# Altium schematic sheet STM32_AUX.SchDoc
size A4; SheetNumber: 8; SheetTotal: 13
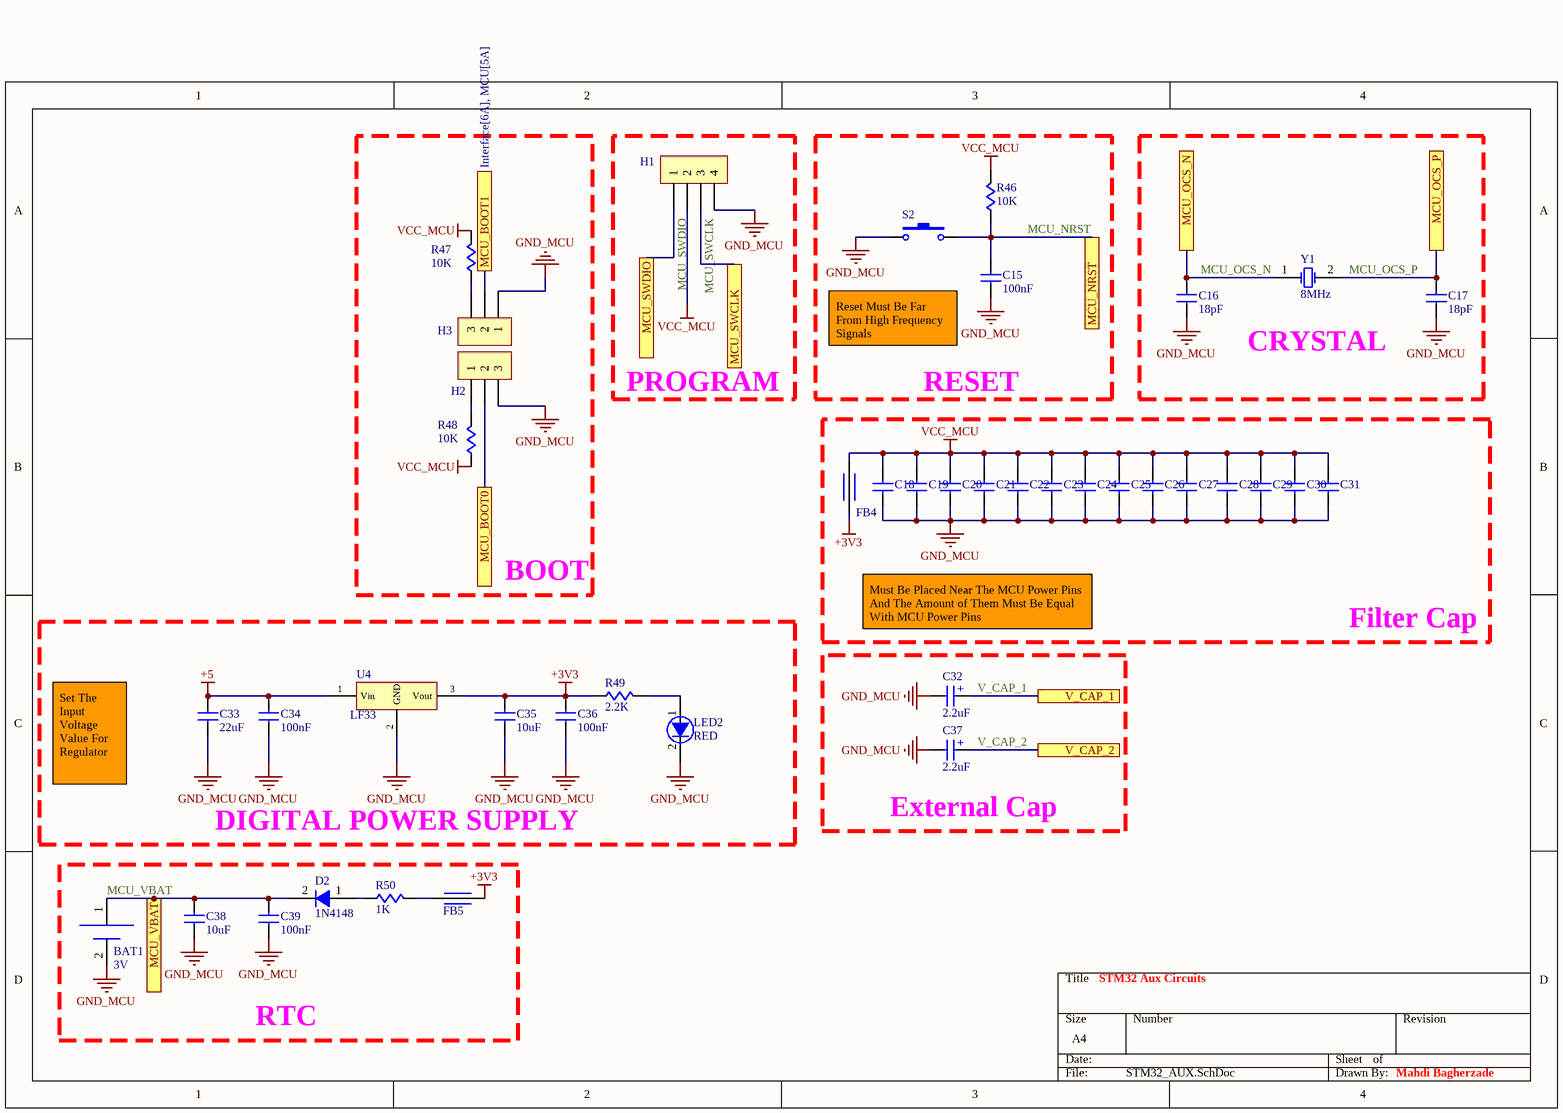
[diagram p0: STM32_AUX.SchDoc]

## Parts
BAT1  Voltage: 3V  [BAT-HOLDER-SMD-1220]  (hidden comment: Bat Holder 2016-SMD)
C15  value 100nF  [C-0805]  (hidden comment: CAP Cer 100nF-50V-X7R-SMD)
C16  value 18pF  [C-0805]  (hidden comment: CAP Cer 18pF-50V-X7R-SMD)
C17  value 18pF  [C-0805]  (hidden comment: CAP Cer 18pF-50V-X7R-SMD)
C18  CAP Cer 100nF-50V-X7R-SMD  [C-0805]  (value not drawn)
C19  CAP Cer 100nF-50V-X7R-SMD  [C-0805]  (value not drawn)
C20  CAP Cer 100nF-50V-X7R-SMD  [C-0805]  (value not drawn)
C21  CAP Cer 100nF-50V-X7R-SMD  [C-0805]  (value not drawn)
C22  CAP Cer 100nF-50V-X7R-SMD  [C-0805]  (value not drawn)
C23  CAP Cer 100nF-50V-X7R-SMD  [C-0805]  (value not drawn)
C24  CAP Cer 100nF-50V-X7R-SMD  [C-0805]  (value not drawn)
C25  CAP Cer 100nF-50V-X7R-SMD  [C-0805]  (value not drawn)
C26  CAP Cer 100nF-50V-X7R-SMD  [C-0805]  (value not drawn)
C27  CAP Cer 100nF-50V-X7R-SMD  [C-0805]  (value not drawn)
C28  CAP Cer 100nF-50V-X7R-SMD  [C-0805]  (value not drawn)
C29  CAP Cer 100nF-50V-X7R-SMD  [C-0805]  (value not drawn)
C30  CAP Cer 100nF-50V-X7R-SMD  [C-0805]  (value not drawn)
C31  CAP Cer 100nF-50V-X7R-SMD  [C-0805]  (value not drawn)
C32  value 2.2uF  [TAN-A]  (hidden comment: CAP Tantal 2.2uF-10V-A-SMD)
C33  value 22uF  [C-0805]  (hidden comment: CAP Cer 22uF-50V-X7R-SMD)
C34  value 100nF  [C-0805]  (hidden comment: CAP Cer 100nF-50V-X7R-SMD)
C35  value 10uF  [C-0805]  (hidden comment: CAP Cer 10uF-50V-X7R-SMD)
C36  value 100nF  [C-0805]  (hidden comment: CAP Cer 100nF-50V-X7R-SMD)
C37  value 2.2uF  [TAN-A]  (hidden comment: CAP Tantal 2.2uF-10V-A-SMD)
C38  value 10uF  [C-0805]  (hidden comment: CAP Cer 10uF-50V-X7R-SMD)
C39  value 100nF  [C-0805]  (hidden comment: CAP Cer 100nF-50V-X7R-SMD)
D2  Code: 1N4148  [SOD80]  (hidden comment: Diode 1N4148-SMD)
FB4  FERRITE BEAD  [FB-0805]  (value not drawn)
FB5  Ferrite Bead SMD  [FB-0805]  (value not drawn)
H1  Header 4x1 Pin -Straight-Male-2.54mm  [H-4pin-M-S]  (value not drawn)
H2  Header 3x1 Pin -Straight-Male-2.54mm  [H-3pin-M-S]  (value not drawn)
H3  Header 3x1 Pin -Straight-Male-2.54mm  [H-3pin-M-S]  (value not drawn)
LED2  Color: RED  [LED-1206-R]  (hidden comment: LED RED-1206-SMD)
R46  value 10K  [R-0805]  (hidden comment: RES 10K-5%-1/8W-SMD)
R47  value 10K  [R-0805]  (hidden comment: RES 10K-5%-1/8W-SMD)
R48  value 10K  [R-0805]  (hidden comment: RES 10K-5%-1/8W-SMD)
R49  value 2.2K  [R-0805]  (hidden comment: RES 2.2K-5%-1/8W-SMD)
R50  value 1K  [R-0805]  (hidden comment: RES 1K-5%-1/8W-SMD)
S2  Push Button 3x6mm-2Pin-SMD  [SW-SMD-2pin-3x6]  (value not drawn)
U4  Reg LF33-3.3V-SMD  [TO252-3pin]  (value not drawn)
Y1  value 8MHz  [CRYSTAL-SMD]  (hidden comment: Crystal 8MHz-SMD)

## Blocks framed on the sheet
BOOT: H2 H3 R47 R48
PROGRAM: H1
RESET: C15 R46 S2
CRYSTAL: C16 C17 Y1
Filter Cap: C18-C31 FB4
DIGITAL POWER SUPPLY: C33-C36 LED2 R49 U4
External Cap: C32 C37
RTC: BAT1 C38 C39 D2 FB5 R50

## Ports
MCU_BOOT0 (see Interface[6A], MCU[5C]), MCU_BOOT1 (see Interface[6A], MCU[5A]), MCU_NRST (see Interface[6B], MCU[5C]), MCU_OCS_N (see Interface[6B], MCU[5C]), MCU_OCS_P (see Interface[6B], MCU[5C]), MCU_SWCLK (see Interface[6A], MCU[3A]), MCU_SWDIO (see Interface[6A], MCU[3A]), MCU_VBAT (see Interface[6B], MCU[4D]), V_CAP_1 (see Interface[6B], MCU[5C]), V_CAP_2 (see Interface[6B], MCU[5C])

## Nets
+3V3: C35.2 C36.2 FB4.1 FB5.1 R49.1 U4.3(Vout)
+5: C33.2 C34.2 U4.1(Vin)
GND_MCU: BAT1.2(-) C15.1 C16.1 C17.1 C18.2 C19.2 C20.2 C21.2 C22.2 C23.2 C24.2 C25.2 C26.2 C27.2 C28.2 C29.2 C30.2 C31.2 C32.2 C33.1 C34.1 C35.1 C36.1 C37.2 C38.1 C39.1 H1.4 H2.3 H3.1 LED2.2(C) S2.1 U4.2(GND)
VCC_MCU: C18.1 C19.1 C20.1 C21.1 C22.1 C23.1 C24.1 C25.1 C26.1 C27.1 C28.1 C29.1 C30.1 C31.1 FB4.2 H1.2 R46.2 R47.1 R48.1
MCU_BOOT0: H2.2 ; port MCU_BOOT0
MCU_BOOT1: H3.2 ; port MCU_BOOT1
MCU_NRST: C15.2 R46.1 S2.2 ; port MCU_NRST
MCU_OCS_N: C16.2 Y1.1(OSC1) ; port MCU_OCS_N
MCU_OCS_P: C17.2 Y1.2(OSC2) ; port MCU_OCS_P
MCU_SWCLK: H1.3 ; port MCU_SWCLK
MCU_SWDIO: H1.1 ; port MCU_SWDIO
MCU_VBAT: BAT1.1(+) C38.2 C39.2 D2.2(C) ; port MCU_VBAT
V_CAP_1: C32.1 ; port V_CAP_1
V_CAP_2: C37.1 ; port V_CAP_2
NetD2_1: D2.1(A) R50.1
NetFB5_2: FB5.2 R50.2
NetH2_1: H2.1 R48.2
NetH3_3: H3.3 R47.2
NetLED2_1: LED2.1(A) R49.2

## Notes on the sheet
- Reset Must Be Far From High Frequency Signals
- Must Be Placed Near The MCU Power Pins And The Amount of Them Must Be Equal With MCU Power Pins
- Set The Input Voltage Value For Regulator
- STM32 Aux Circuits
- Mahdi Bagherzade
- (in symbol CAP-TAN) +

## Library data of the parts
BAT1 = BATTERY HOLDER: BATTERY; Phone Number: 0915 8700 314; Publisher: Mahdi Bagherzadeh; ComponentLink1Description: Linkedin; ComponentLink1URL: https://ir.linkedin.com/in/mahdi-bagherzade; Published Date: 9-15-2024; Size: 2016; Type: SMD
C15-C17 C33-C36 C38 C39 = CAP-CER: CAPACITOR; Phone Number: 0915 8700 314; Voltage: 50V; Tolerance: X7R; Type: SMD; Publisher: Mahdi Bagherzadeh; ComponentLink1Description: Linkedin; ComponentLink1URL: https://ir.linkedin.com/in/mahdi-bagherzade; Published Date: 9-15-2024
C18-C31 = CAP-CER: CAPACITOR; Phone Number: 0915 8700 314; Voltage: 50V; Tolerance: X7R; Type: SMD; Value: 100nF; Publisher: Mahdi Bagherzadeh; ComponentLink1Description: Linkedin; ComponentLink1URL: https://ir.linkedin.com/in/mahdi-bagherzade; Published Date: 9-15-2024
C32 C37 = CAP-TAN: CAPACITOR; Phone Number: 0915 8700 314; Voltage: 10V; Type: SMD; Publisher: Mahdi Bagherzadeh; ComponentLink1Description: Linkedin; ComponentLink1URL: https://ir.linkedin.com/in/mahdi-bagherzade; Published Date: 9-15-2024; Size: A
D2 = DIODE: Phone Number: 0915 8700 314; Type: SMD; Publisher: Mahdi Bagherzadeh; ComponentLink1Description: Linkedin; ComponentLink1URL: https://ir.linkedin.com/in/mahdi-bagherzade; Published Date: 9-15-2024
FB4 FB5 = FERRITE BEAD: INDUCATOR; Phone Number: 0915 8700 314; Publisher: Mahdi Bagherzadeh; ComponentLink1Description: Linkedin; ComponentLink1URL: https://ir.linkedin.com/in/mahdi-bagherzade; Published Date: 9-15-2024
  FB5: Type: SMD
H1 = HEADER-4pin: HEADER; Phone Number: 0915 8700 314; Publisher: Mahdi Bagherzadeh; ComponentLink1Description: Linkedin; ComponentLink1URL: https://ir.linkedin.com/in/mahdi-bagherzade; Published Date: 9-15-2024; Type: Straight-Male; Size: 2.54mm
H2 H3 = HEADER-3pin: HEADER; Phone Number: 0915 8700 314; Publisher: Mahdi Bagherzadeh; ComponentLink1Description: Linkedin; ComponentLink1URL: https://ir.linkedin.com/in/mahdi-bagherzade; Published Date: 9-15-2024; Type: Straight-Male; Size: 2.54mm
LED2 = LED: Phone Number: 0915 8700 314; Type: SMD; Publisher: Mahdi Bagherzadeh; ComponentLink1Description: Linkedin; ComponentLink1URL: https://ir.linkedin.com/in/mahdi-bagherzade; Published Date: 9-15-2024; Size: 1206
R46-R50 = RES: RESISTOR; Phone Number: 0915 8700 314; Tolerance: 5%; Power: 1/8W; Publisher: Mahdi Bagherzadeh; ComponentLink1Description: Linkedin; ComponentLink1URL: https://ir.linkedin.com/in/mahdi-bagherzade; Published Date: 9-15-2024; Type: SMD
S2 = PUSH BUTTON: SWITCH; Phone Number: 0915 8700 314; Publisher: Mahdi Bagherzadeh; ComponentLink1Description: Linkedin; ComponentLink1URL: https://ir.linkedin.com/in/mahdi-bagherzade; Published Date: 9-15-2024; Size: 3x6mm; Type: 2Pin-SMD
U4 = LF33: REGULATOR; Phone Number: 0915 8700 314; Voltage: 3.3V; Publisher: Mahdi Bagherzadeh; ComponentLink1Description: Linkedin; ComponentLink1URL: https://ir.linkedin.com/in/mahdi-bagherzade; Published Date: 9-15-2024; Type: SMD; Code: LF33
Y1 = CRYSTAL: Phone Number: 0915 8700 314; Publisher: Mahdi Bagherzadeh; ComponentLink1Description: Linkedin; ComponentLink1URL: https://ir.linkedin.com/in/mahdi-bagherzade; Published Date: 9-15-2024; Type: SMD